# EAGLE design RGB_shot (EAGLE 6.1)
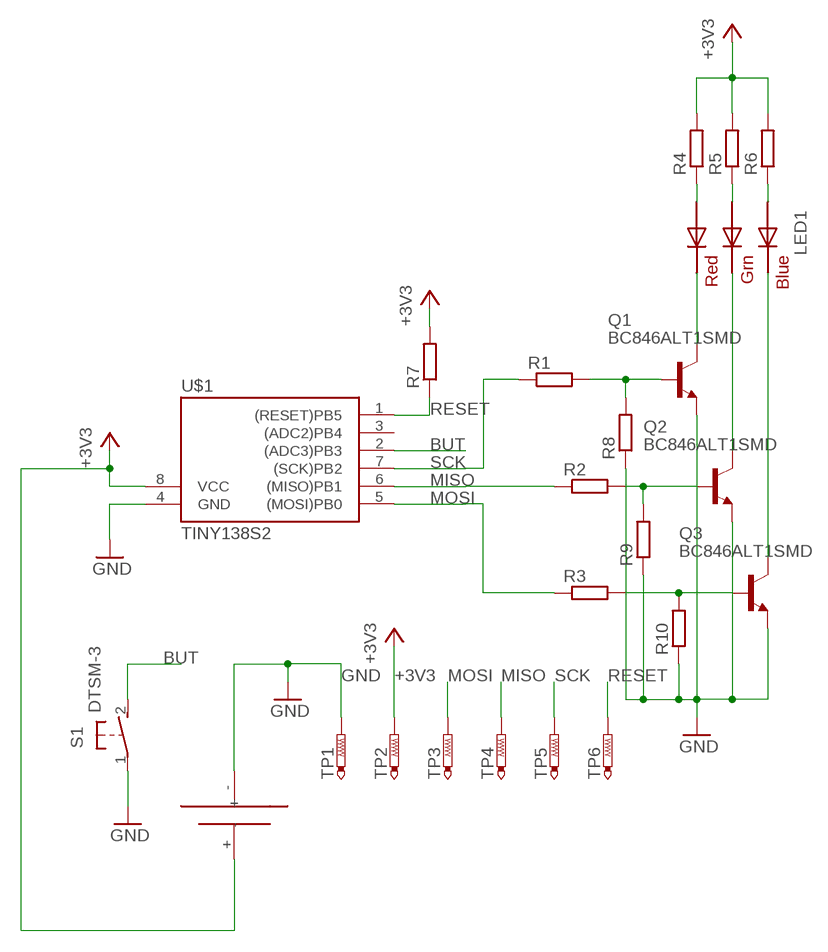
[diagram p0: schematic, sheet 1]

## Parts
LED1  RGBLED5050  [RGBLED5050]
Q1  BC846ALT1SMD  [SOT23]
Q2  BC846ALT1SMD  [SOT23]
Q3  BC846ALT1SMD  [SOT23]
R1  R-EU_M0805  [M0805]
R2  R-EU_M0805  [M0805]
R3  R-EU_M0805  [M0805]
R4  R-EU_M0805  [M0805]
R5  R-EU_M0805  [M0805]
R6  R-EU_M0805  [M0805]
R7  R-EU_M0805  [M0805]
R8  R-EU_M0805  [M0805]
R9  R-EU_M0805  [M0805]
R10  R-EU_M0805  [M0805]
S1  DTSM-3  [DTSM-3]
TP1  PTR1TP11R  [TP11R]
TP2  PTR1TP11R  [TP11R]
TP3  PTR1TP11R  [TP11R]
TP4  PTR1TP11R  [TP11R]
TP5  PTR1TP11R  [TP11R]
TP6  PTR1TP11R  [TP11R]
U$1  TINY138S2  [SO08]
U$2  BAT33_1220  [BAT1220]

## Nets
+3V3: R4.2 R5.2 R6.2 R7.2 TP2.TP U$1.8(VCC) U$2.+
BUT: S1.2 U$1.2((ADC3)PB3)
GND: Q1.2(E) Q2.2(E) Q3.2(E) R8.1 R9.1 R10.1 S1.1 TP1.TP U$1.4(GND) U$2.-
MISO: R2.1 TP4.TP U$1.6((MISO)PB1)
MOSI: R3.1 TP3.TP U$1.5((MOSI)PB0)
N$3: LED1.2(RED_A) R4.1
N$4: LED1.1(GREEN_A) R5.1
N$5: LED1.3(BLUE_A) R6.1
N$6: LED1.5(RED_C) Q1.3(C)
N$7: LED1.6(GREEN_C) Q2.3(C)
N$8: LED1.4(BLUE_C) Q3.3(C)
N$9: Q1.1(B) R1.2 R8.2
N$10: Q2.1(B) R2.2 R9.2
N$11: Q3.1(B) R3.2 R10.2
RESET: R7.1 TP6.TP U$1.1((RESET)PB5)
SCK: R1.1 TP5.TP U$1.7((SCK)PB2)
Unconnected: U$1.3((ADC2)PB4)

## Library data of the parts
LED1 = adafruit:RGBLED: For 5050 RGB LEDs, the order of the LEDs may vary from one manufacturer to another!
Q1-Q3 = transistor-npn:BC846*: NPN Transistor
R1-R10 = resistor:R-EU_: RESISTOR, European symbol
S1 = switch-tact:DTSM-3
TP1-TP6 = testpad:PTR1: TEST PIN
U$1 = avr-6:TINY13*
U$2 = SashaLib:BAT33_1220

## Board
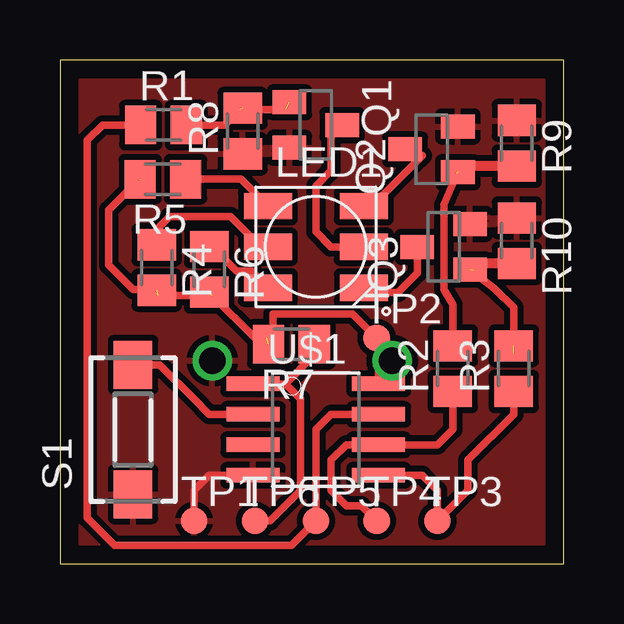
[diagram p1: board, top side]

Size 21 x 21 mm. Coordinates in mm from the lower left corner, seen from the top.
Outline: 0,0 21,0 21,21 0,21 0,0
Copper layers (1*16): Top 0.035mm / dielectric 1.5mm / Bottom 0.035mm
Design rules: minimum track width 10mil, minimum drill 24mil, track to track 8mil, track to pad 8mil, pad to pad 8mil, via to via 8mil, smd to smd 8mil, copper to edge 30mil, drill to drill 8mil, minimum pad ring 10mil, minimum via ring 8mil, stop-mask expansion 4mil, vias tented up to drill 0mil, thermal gap 10mil

### Footprints (pad centres in the part's own frame; a part is rotated, then mirrored left to right if it is on the bottom)
RGBLED5050 = smd 2 x 1.1: 1 -2,1.7; 2 -2,0; 3 -2,-1.7; 4 2,-1.7; 5 2,0; 6 2,1.7
SOT23 = smd 1 x 1.4: 1 -0.95,-1.1; 2 0.95,-1.1; 3 0,1.1
M0805 = smd 1.3 x 1.6: 1 -0.95,0; 2 0.95,0
DTSM-3 = smd 2 x 1.6: 1 -2.7,0; 2 2.7,0
TP11R = smd 1.1 x 1.1: TP 0,0
SO08 = smd 0.61 x 2.21: 1 -1.905,-2.616; 2 -0.635,-2.616; 3 0.635,-2.616; 4 1.905,-2.616; 5 1.905,2.616; 6 0.635,2.616; 7 -0.635,2.616; 8 -1.905,2.616
BAT1220 = drill 1.1: + 7.5,11; - 0,11

### Placement (x,y rotation side)
LED1  10.67,13.21 0 top
Q1  10.67,18.29 270 top
Q2  15.49,17.27 90 top
Q3  16,13.21 90 top
R1  4.32,18.29 0 top
R2  16.38,8.13 90 top
R3  18.92,8.13 90 top
R4  4.04,12.34 270 top
R5  4.29,16.03 180 top
R6  6.22,12.27 270 top
R7  9.65,9.14 180 top
R8  7.62,18.03 90 top
R9  19.05,17.53 270 top
R10  19.05,13.46 270 top
S1  3.05,5.59 90 top
TP1  5.59,1.78 0 top
TP2  13.21,9.4 0 top
TP3  15.75,1.78 0 top
TP4  13.21,1.78 0 top
TP5  10.67,1.78 0 top
TP6  8.13,1.78 0 top
U$1  10.67,5.59 270 top
U$2  6.35,-2.54 0 top

### Tracks (layer width: path | path; a pad name or v marks a point on that pad's centre or on a via)
+3V3  (4 unrouted)
  Top 0.305: U$1.8 13.28,9.32 TP2.TP | TP2.TP 12.19,10.41 8.89,10.41 8.89,9.65 8.64,9.4 8.13,9.4 6.35,11.18 4.06,11.18 3.81,11.43 3.05,11.43 2.03,12.45 2.03,14.73 3.3,16 | U$2.+ 13.64,8.97 TP2.TP
BUT
  Top 0.305: S1.2 4.16,8.29 5.59,6.86 6.22,6.22 U$1.2
GND
  Top 0.305: S1.1 3.21,2.89 | TP1.TP 5.59,3.05 6.22,3.68 U$1.4
  pour Top (isolate 0.254, rank 2): 0.08,20.95 20.95,20.95 20.95,0.03 0.08,0.03
MISO
  Top 0.305: R2.1 16.38,5.59 15.75,4.95 U$1.6 11.94,4.95 11.3,4.32 11.3,3.05 11.94,2.41 12.57,2.41 TP4.TP
MOSI
  Top 0.305: R3.1 18.92,6.22 17.02,4.32 17.02,3.05 TP3.TP 15.75,3.05 15.11,3.68 U$1.5
N$3
  Top 0.305: LED1.2 8.38,13.21 7.37,14.22 7.11,14.48 4.57,14.48 4.06,13.97 4.06,13.32 R4.1
N$4
  Top 0.305: R5.1 7.55,16.03 LED1.1
N$5
  Top 0.305: R6.1 6.34,13.22 7.37,12.19 7.98,12.19 LED1.3
N$6
  Top 0.305: LED1.5 11.3,13.21 10.67,13.84 10.67,15.75 11.3,16.38 11.3,17.82 Q1.3
N$7
  Top 0.305: Q2.3 15.11,17.02 13.84,15.75 13.21,15.11 12.87,15.11 LED1.6
N$8
  Top 0.305: Q3.3 14.9,12.11 14.1,11.3 12.87,11.3 LED1.4
N$9  (2 unrouted)
  Top 0.305: R1.2 6.86,18.29 7.49,18.92 9.4,18.92
N$10  (1 unrouted)
  Top 0.305: R2.2 16.38,10.79 16,11.43 16,14.97 Q2.1
  Top 0.406: R9.2 16.51,16.58 16.51,16.26
N$11  (2 unrouted)
  Top 0.305: Q3.1 18.12,11.47 18.92,10.67 18.92,8.76
  Top 0.406: R10.2 17.27,12.51 17.27,12.19
RESET
  Top 0.305: TP6.TP 8.76,1.78 10.03,3.05 10.03,6.86 9.4,7.49 | 9.4,7.49 U$1.1 | R7.1 10.6,8.7 9.4,7.49
SCK
  Top 0.305: U$1.7 11.3,6.22 10.67,5.59 TP5.TP 9.65,0.76 2.29,0.76 1.14,1.91 1.14,17.65 1.78,18.29 R1.1